# Altium schematic sheet STN1170_RN-42 CPU Rev2.SchDoc: STN1110 RN-42 Bluetooth Board
size B; DrawnBy: AHonecker; Organization: AH Design; Address1: Designed and; Address2: Produced in NY; Address3: USA; DocumentNumber: 2; Revision: 1; SheetNumber: 2; SheetTotal: 3
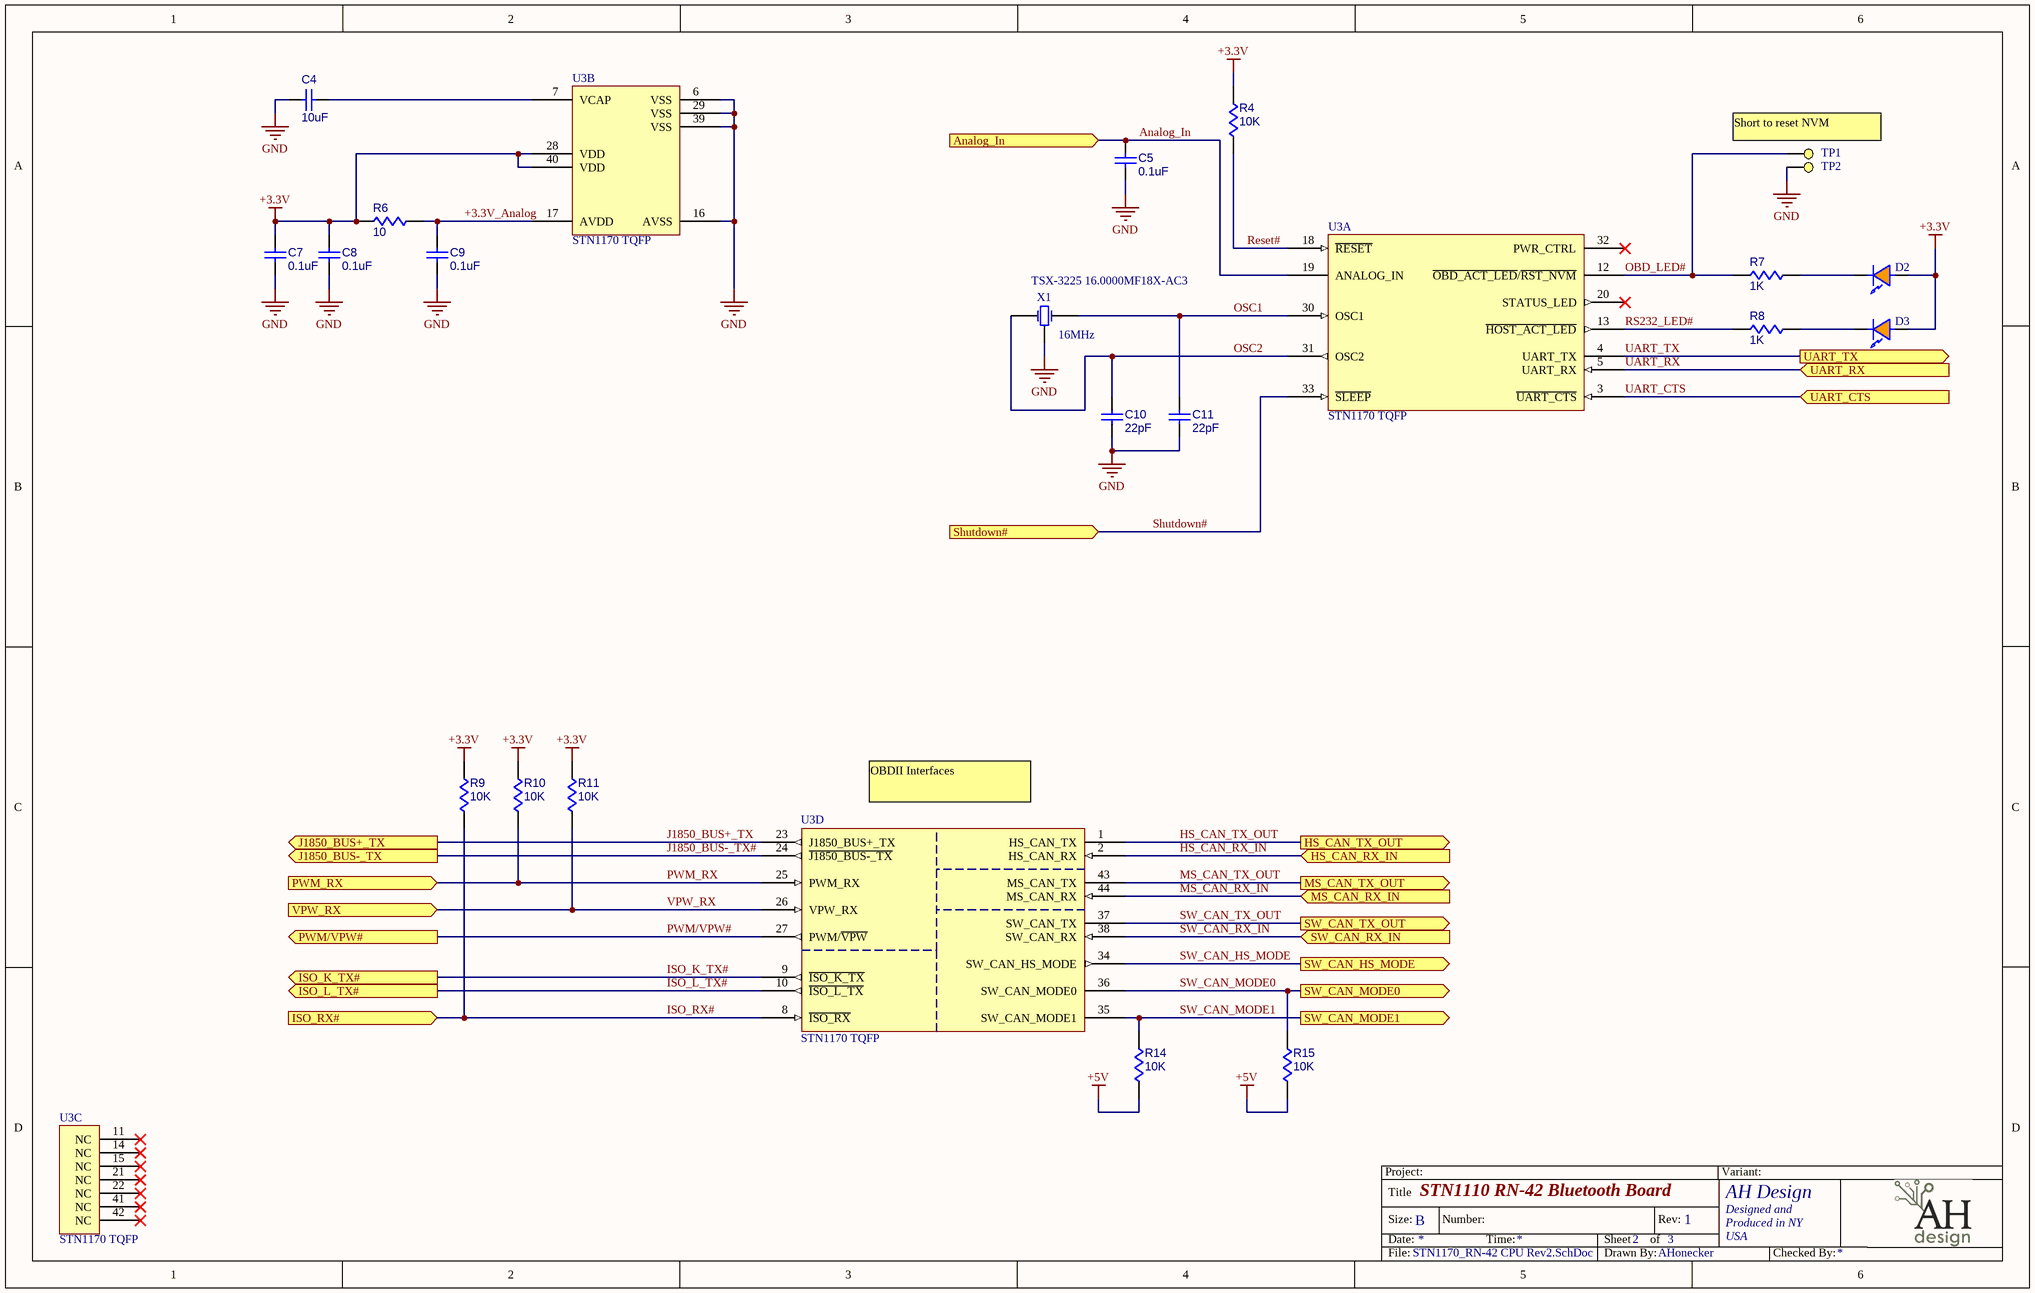
[diagram p0: STN1170_RN-42 CPU Rev2.SchDoc]

## Parts
C4  10uF  [CC0805]
C5  0.1uF  [CC0603]
C7  0.1uF  [CC0603]
C8  0.1uF  [CC0603]
C9  0.1uF  [CC0603]
C10  22pF  [CC0603]
C11  22pF  [CC0603]
D2  APA1606SECK  [KINGBRIGHT_APA1606SECK]  (value not drawn)
D3  APA1606SECK  [KINGBRIGHT_APA1606SECK]  (value not drawn)
R4  10K  [R0603]
R6  10  [R0603]
R7  1K  [R0603]
R8  1K  [R0603]
R9  10K  [R0603]
R10  10K  [R0603]
R11  10K  [R0603]
R14  10K  [R0603]
R15  10K  [R0603]
TP1  (no value)  [TP,0.5mmx0.5mm,RND]  (no BOM)
TP2  (no value)  [TP,0.5mmx0.5mm,RND]  (no BOM)
U3  STN1170 TQFP  [TQFP80P1200X1200X120-44N]  (parts A,B,C,D of 4)  (no BOM)
X1  TSX-3225 16.0000MF18X-AC3  value 16MHz  [Epson_TSX-3225 16.0000MF18X-AC3]

## Ports
Analog_In (in), HS_CAN_RX_IN (in), HS_CAN_TX_OUT (out), ISO_K_TX# (out), ISO_L_TX# (out), ISO_RX# (in), J1850_BUS+_TX (out), J1850_BUS-_TX (out), MS_CAN_RX_IN (in), MS_CAN_TX_OUT (out), PWM/VPW# (out), PWM_RX (in), Shutdown# (in), SW_CAN_HS_MODE (out), SW_CAN_MODE0 (out), SW_CAN_MODE1 (out), SW_CAN_RX_IN (in), SW_CAN_TX_OUT (out), UART_CTS (in), UART_RX (in), UART_TX (out), VPW_RX (in)

## Nets
+3.3V: C7.2 C8.2 D2.A D3.A R4.1 R6.1 R9.1 R10.1 R11.1 U3.28(VDD) U3.40(VDD)
+5V: R14.2 R15.2
GND: C4.2 C5.1 C7.1 C8.1 C9.1 C10.1 C11.1 TP2.1(TP) U3.6(VSS) U3.16(AVSS) U3.29(VSS) U3.39(VSS) X1.GND
+3.3V_Analog: C9.2 R6.2 U3.17(AVDD)
Analog_In: C5.2 U3.19(ANALOG_IN) ; port Analog_In
HS_CAN_RX_IN: U3.2(HS_CAN_RX) ; port HS_CAN_RX_IN
HS_CAN_TX_OUT: U3.1(HS_CAN_TX) ; port HS_CAN_TX_OUT
ISO_K_TX#: U3.9(~{ISO_K_TX}) ; port ISO_K_TX#
ISO_L_TX#: U3.10(~{ISO_L_TX}) ; port ISO_L_TX#
ISO_RX#: R9.2 U3.8(~{ISO_RX}) ; port ISO_RX#
J1850_BUS+_TX: U3.23(J1850_BUS+_TX) ; port J1850_BUS+_TX
J1850_BUS-_TX#: U3.24(~{J1850_BUS-_TX}) ; port J1850_BUS-_TX
MS_CAN_RX_IN: U3.44(MS_CAN_RX) ; port MS_CAN_RX_IN
MS_CAN_TX_OUT: U3.43(MS_CAN_TX) ; port MS_CAN_TX_OUT
OBD_LED#: R7.1 TP1.1(TP) U3.12(~{OBD_ACT_LED}/~{RST_NVM})
OSC1: C11.2 U3.30(OSC1) X1.3(OSC2)
OSC2: C10.2 U3.31(OSC2) X1.1(OSC1)
PWM/VPW#: U3.27(PWM/~{VPW}) ; port PWM/VPW#
PWM_RX: R10.2 U3.25(PWM_RX) ; port PWM_RX
Reset#: R4.2 U3.18(~{RESET})
RS232_LED#: R8.1 U3.13(~{HOST_ACT_LED})
Shutdown#: U3.33(~{SLEEP}) ; port Shutdown#
SW_CAN_HS_MODE: U3.34(SW_CAN_HS_MODE) ; port SW_CAN_HS_MODE
SW_CAN_MODE0: R15.1 U3.36(SW_CAN_MODE0) ; port SW_CAN_MODE0
SW_CAN_MODE1: R14.1 U3.35(SW_CAN_MODE1) ; port SW_CAN_MODE1
SW_CAN_RX_IN: U3.38(SW_CAN_RX) ; port SW_CAN_RX_IN
SW_CAN_TX_OUT: U3.37(SW_CAN_TX) ; port SW_CAN_TX_OUT
UART_CTS: U3.3(~{UART_CTS}) ; port UART_CTS
UART_RX: U3.5(UART_RX) ; port UART_RX
UART_TX: U3.4(UART_TX) ; port UART_TX
VPW_RX: R11.2 U3.26(VPW_RX) ; port VPW_RX
NetC4_1: C4.1 U3.7(VCAP)
NetD2_C: D2.C R7.2
NetD3_C: D3.C R8.2

Not connected (* = marked no-connect by the designer): U3 11(NC)* 14(NC)* 15(NC)* 20(STATUS_LED)* 21(NC)* 22(NC)* 32(PWR_CTRL)* 41(NC)* 42(NC)*

## Notes on the sheet
- (near TP1) Short to reset NVM
- (near U3) OBDII Interfaces
- Project:
- Variant:
- Title
- Size:
- Date:
- B
- Number:
- Time:
- Sheet
- of
- Rev:
- File:
- Drawn By:
- Checked By:

## Library data of the parts
C4 = 10uF,6.3V,CC0805,X5R,+/-20%: 10uF 6.3V, in a CC0805, X5R ,+/-20%,LF; Manufacturer: Kemet Electronics Corp; PartNumber: C0805C106M9PAC; PartStatus1: Active; Voltage: 6.3; Designator: C?; Component Subkind: Capacitor; Approved: Yes; ItemWeight1_mg: 21.1817970275879; ItemWeight2_mg: 0; Approver: IHS; Value: 10uF; LeadFree: Yes; RoHS: Yes; Published: 1/5/2011 12:04:51 PM; Publisher: AltiumDBManager1.4-MWyman; ItemID: 10uF,6.3V,CC0805,X5R,+/-20%; Component Kind: Standard; Component Type: Standard; Manufacturer2: Cal-Chip Electronics; Manufacturer3: Yageo Corp; Manufacturer4: -; Pin Count: 2; Material: X5R; Tolerance: +/-20%; Status: Active; ComponentLink1URL: \PassivesDatasheets\F3102_CE.pdf; ComponentLink2URL: \PassivesDatasheets\gmc_series.pdf; ComponentLink3URL: \PassivesDatasheets\PSG_2006.pdf; ComponentLink4URL: -; ComponentLink1Description: Datasheet; ComponentLink2Description: Datasheet; ComponentLink3Description: Datasheet; ComponentLink4Description: Datasheet; PartNumber4: -; PartStatus4: -; ItemWeight3_mg: 0; ItemWeight4_mg: 0
C5 C7-C9 = 0.1uF,50V,CC0603,X7R,+/-20%: 0.1uF 50V, in a CC0603, X7R ,+/-20%,LF; Manufacturer: Kemet; PartNumber: C0603C104M5RAC; Voltage: 50; Designator: C?; Component Subkind: Capacitor; Approved: Pending; Value: 0.1uF; LeadFree: Yes; RoHS: Yes; Published: 7/18/2007; Publisher: AltiumdBManager; ItemID: 0.1uF,50V,CC0603,X7R,+/-20%; Component Kind: Standard; Component Type: Standard; Manufacturer2: CAL-CHIP; Manufacturer3: -; Manufacturer4: -; Pin Count: 2; PartNumber2: GMC10X7R10450NT-LF; Material: X7R; Tolerance: +/-20%; ComponentLink1URL: \PassivesDatasheets\F3102_CE.pdf; ComponentLink2URL: \PassivesDatasheets\gmc_series.pdf; ComponentLink3URL: -; ComponentLink4URL: -; ComponentLink1Description: Datasheet; ComponentLink2Description: Datasheet; ComponentLink3Description: Datasheet; ComponentLink4Description: Datasheet
C10 C11 = 22pF,10V,CC0603,COG,+/-2%: 22pF 10V, in a CC0603, COG ,+/-2%,LF; Manufacturer: Kemet Electronics Corp; PartNumber: C0603C220G8GAC; PartStatus1: Active; Voltage: 10; Designator: C?; Component Subkind: Capacitor; Approved: Yes; ItemWeight1_mg: 291.799987792969; ItemWeight2_mg: 0; Approver: IHS; Value: 22pF; LeadFree: Yes; RoHS: Yes; Published: 1/5/2011 12:08:32 PM; Publisher: AltiumDBManager1.4-MWyman; ItemID: 22pF,10V,CC0603,COG,+/-2%; Component Kind: Standard; Component Type: Standard; Manufacturer2: -; Manufacturer3: -; Manufacturer4: -; Pin Count: 2; PartNumber2: -; Material: COG; PartNumber3: -; Tolerance: +/-2%; PartNumber4: -; Status: Active; ComponentLink1URL: \PassivesDatasheets\F3102_CE.pdf; ComponentLink2URL: -; ComponentLink3URL: -; ComponentLink4URL: -; ComponentLink1Description: Datasheet; ComponentLink2Description: Datasheet; ComponentLink3Description: Datasheet; ComponentLink4Description: Datasheet; PartStatus2: -; PartStatus3: -; PartStatus4: -; ItemWeight3_mg: 0; ItemWeight4_mg: 0
D2 D3 = KINGBRIGHT_APA1606SECK: LED 1.6X0.6MM 601NM Orange Right-Angle SMD; Manufacturer: Kingbright Corp.; Approved: No; TargetLibrary: LEDs; Value: 2.1V; ComponentLink1Description: Datasheet; ComponentLink1URL: http://www.us.kingbright.com/images/catalog/SPEC/APA1606SECK.pdf; LeadFree: Yes; PartNumber: APA1606SECK; Published: 1/18/2010; Publisher: Vanteon - AHonecker; RoHS: Yes; Status: Active
R4 R9-R11 R14 R15 = 10K,R0603,5%: 10K, Gen Purp Chip, R0603 0.1W 5%; Manufacturer: Panasonic; PartNumber: ERJ3GEYJ103V; Component SubKind: Resistor; Voltage: 75; MetricFootprint: R1608MM; Value: 10K; Manufacturer2: Vishay/Dale; Manufacturer3: KOA/Speer; Manufacturer4: ROHM; PartNumber2: CRCW060310KJKED; PartNumber3: RK73B1JTTD103J; PartNumber4: MCR03EZPJ103; Tolerance: 5%; Material: Thick-Film; Watts: 0.1W; LeadFree: Yes; RoHS: Yes; Published: 7/16/2009; Publisher: AltiumDBManager1.1; ItemID: 10K,R0603,5%; Component Kind: Standard; Component Type: Standard; Pin Count: 2; Spice Prefix: R; ComponentLink1URL: http://industrial.panasonic.com/www-data/pdf/AOA0000/AOA0000CE1.pdf; ComponentLink2URL: \PassivesDatasheets\Vishay_dcrcw.pdf; ComponentLink3URL: \PassivesDatasheets\KOA_Speer_2%_5%.pdf; ComponentLink4URL: \PassivesDatasheets\mcr03.pdf; ComponentLink1Description: Datasheet; ComponentLink2Description: Datasheet; ComponentLink3Description: Datasheet; ComponentLink4Description: Datasheet
R6 = 10,R0603,5%: 10, Gen Purp Chip, R0603 0.1W 5%; Manufacturer: Panasonic; PartNumber: ERJ3GEYJ100V; Component SubKind: Resistor; Voltage: 75; MetricFootprint: R1608MM; Value: 10; Manufacturer2: Vishay/Dale; Manufacturer3: KOA/Speer; Manufacturer4: ROHM; PartNumber2: CRCW060310RJKED; PartNumber3: RK73B1JTTD100J; PartNumber4: MCR03EZPJ100; Tolerance: 5%; Material: Thick-Film; Watts: 0.1W; LeadFree: Yes; RoHS: Yes; Published: 7/16/2009; Publisher: AltiumDBManager1.1; ItemID: 10,R0603,5%; Component Kind: Standard; Component Type: Standard; Pin Count: 2; Spice Prefix: R; ComponentLink1URL: http://industrial.panasonic.com/www-data/pdf/AOA0000/AOA0000CE1.pdf; ComponentLink2URL: \PassivesDatasheets\Vishay_dcrcw.pdf; ComponentLink3URL: \PassivesDatasheets\KOA_Speer_2%_5%.pdf; ComponentLink4URL: \PassivesDatasheets\mcr03.pdf; ComponentLink1Description: Datasheet; ComponentLink2Description: Datasheet; ComponentLink3Description: Datasheet; ComponentLink4Description: Datasheet
R7 R8 = 1K,R0603,5%: 1K, Gen Purp Chip, R0603 0.1W 5%; Manufacturer: Panasonic; PartNumber: ERJ3GEYJ102V; Component SubKind: Resistor; Voltage: 75; MetricFootprint: R1608MM; Value: 1K; Manufacturer2: Vishay/Dale; Manufacturer3: KOA/Speer; Manufacturer4: ROHM; PartNumber2: CRCW06031KJKED; PartNumber3: RK73B1JTTD102J; PartNumber4: MCR03EZPJ102; Tolerance: 5%; Material: Thick-Film; Watts: 0.1W; LeadFree: Yes; RoHS: Yes; Published: 7/16/2009; Publisher: AltiumDBManager1.1; ItemID: 1K,R0603,5%; Component Kind: Standard; Component Type: Standard; Pin Count: 2; Spice Prefix: R; ComponentLink1URL: http://industrial.panasonic.com/www-data/pdf/AOA0000/AOA0000CE1.pdf; ComponentLink2URL: \PassivesDatasheets\Vishay_dcrcw.pdf; ComponentLink3URL: \PassivesDatasheets\KOA_Speer_2%_5%.pdf; ComponentLink4URL: \PassivesDatasheets\mcr03.pdf; ComponentLink1Description: Datasheet; ComponentLink2Description: Datasheet; ComponentLink3Description: Datasheet; ComponentLink4Description: Datasheet
TP1 TP2 = TP, 0.5mm x 0.5mm SMT, RND: 0.5mm diameter testpoint
U3 = STN1170_TQFP: Multiprotocol OBD to UART Interpreter with Medium-Speed CAN and Single-Wire CAN support; Manufacturer: Scantool.net; PartNumber: STN1170 TQFP
X1 = TSX-3225 16.0000MF18X-AC3: CRYSTAL 16.0000MHZ 9PF SMD; Manufacturer: Epson; Frequency Stability: +/-18ppm; Frequency Tolerance: +/-10ppm; PartNumber: TSX-3225 16.0000MF18X-AC3